# EAGLE design twitterer (EAGLE 7.1.0)
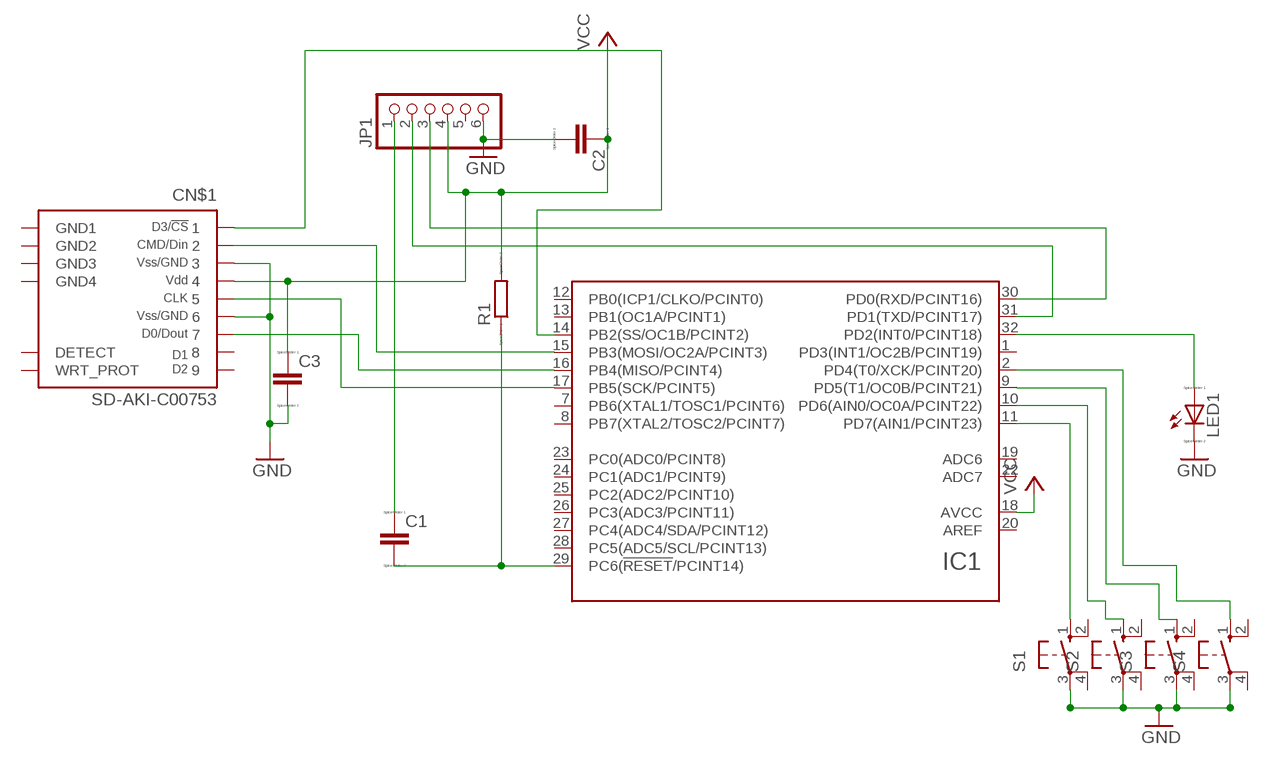
[diagram p0: schematic, sheet 1]

## Parts
C1  CC0603  [C0603]
C2  CC0603  [C0603]
C3  CC0603  [C0603]
CN$1  SD-AKI-C00753  [C-1734234]
IC1  ATMEGA48/88/168/328-AU  [TQFP32-08]
JP1  PINHD-1X6  [1X06]
LED1  LED_ELD260  [LED_LD260]
R1  RR0603  [R0603]
S1  10-XX  [B3F-10XX]
S2  10-XX  [B3F-10XX]
S3  10-XX  [B3F-10XX]
S4  10-XX  [B3F-10XX]

## Nets
GND: C2.2 C3.2 CN$1.3 CN$1.6 JP1.6 LED1.K(C) S1.3(P) S2.3(P) S3.3(P) S4.3(P)
N$1: C1.1 JP1.1
N$2: C1.2 IC1.29(PC6(!RESET!/PCINT14)) R1.1
N$3: IC1.31(PD1(TXD/PCINT17)) JP1.2
N$4: IC1.30(PD0(RXD/PCINT16)) JP1.3
N$5: CN$1.1 IC1.14(PB2(SS/OC1B/PCINT2))
N$6: CN$1.2 IC1.15(PB3(MOSI/OC2A/PCINT3))
N$11: CN$1.7 IC1.16(PB4(MISO/PCINT4))
N$12: CN$1.5 IC1.17(PB5(SCK/PCINT5))
N$13: IC1.32(PD2(INT0/PCINT18)) LED1.A
N$14: IC1.11(PD7(AIN1/PCINT23)) S1.1(S)
N$15: IC1.10(PD6(AIN0/OC0A/PCINT22)) S2.1(S)
N$16: IC1.9(PD5(T1/OC0B/PCINT21)) S3.1(S)
N$17: IC1.2(PD4(T0/XCK/PCINT20)) S4.1(S)
VCC: C2.1 C3.1 CN$1.4 IC1.18(AVCC) JP1.4 R1.2
Unconnected: CN$1.8 CN$1.9 CN$1.DETECT CN$1.WRT_PROT IC1.1(PD3(INT1/OC2B/PCINT19)) IC1.7(PB6(XTAL1/TOSC1/PCINT6)) IC1.8(PB7(XTAL2/TOSC2/PCINT7)) IC1.12(PB0(ICP1/CLKO/PCINT0)) IC1.13(PB1(OC1A/PCINT1)) IC1.19(ADC6) IC1.20(AREF) IC1.22(ADC7) IC1.23(PC0(ADC0/PCINT8)) IC1.24(PC1(ADC1/PCINT9)) IC1.25(PC2(ADC2/PCINT10)) IC1.26(PC3(ADC3/PCINT11)) IC1.27(PC4(ADC4/SDA/PCINT12)) IC1.28(PC5(ADC5/SCL/PCINT13)) JP1.5 S1.2(S1) S1.4(P1) S2.2(S1) S2.4(P1) S3.2(S1) S3.4(P1) S4.2(S1) S4.4(P1)

## Power pins joined to a net without a drawn wire
GND: IC1.3(GND) IC1.5(GND) IC1.21(GND)
GND1: CN$1.GND1
GND2: CN$1.GND2
GND3: CN$1.GND3
GND4: CN$1.GND4
VCC: IC1.4(UCC) IC1.6(UCC)

## Library data of the parts
C1-C3 = eagle-ltspice:C: CAPACITOR, European symbol; SPICEMODEL: NONE; SPICEPREFIX: C
CN$1 = sd-card:SD-AKI-C00753: SD Card slot C-00753 Manufacturer: Unknown Distributor: Akizuki denshi DataSheet: http://akizukidenshi.com/catalog/g/gC-00753/ Remarks: @150 © afwan 2009/01 afwan717-right@yahoo.co.jp
IC1 = atmel_tiny24-44-84tiny48-88mega48-88-168-328:ATMEGA48/88/168/328
JP1 = pinhead:PINHD-1X6: PIN HEADER
LED1 = eagle-ltspice:LED_E: LED Source: http://www.osram.convergy.de Source: www.luxeon.com Source: www.kingbright.com; SPICEMODEL: NONE; SPICEPREFIX: D; SPICETYPE: diode
R1 = eagle-ltspice:R: RESISTOR, European symbol; SPICEMODEL: NONE; SPICEPREFIX: R
S1-S4 = switch-omron:10-XX: OMRON SWITCH; MPN: B3F-1000; OC_FARNELL: 176432; OC_NEWARK: 36M3542

## Board
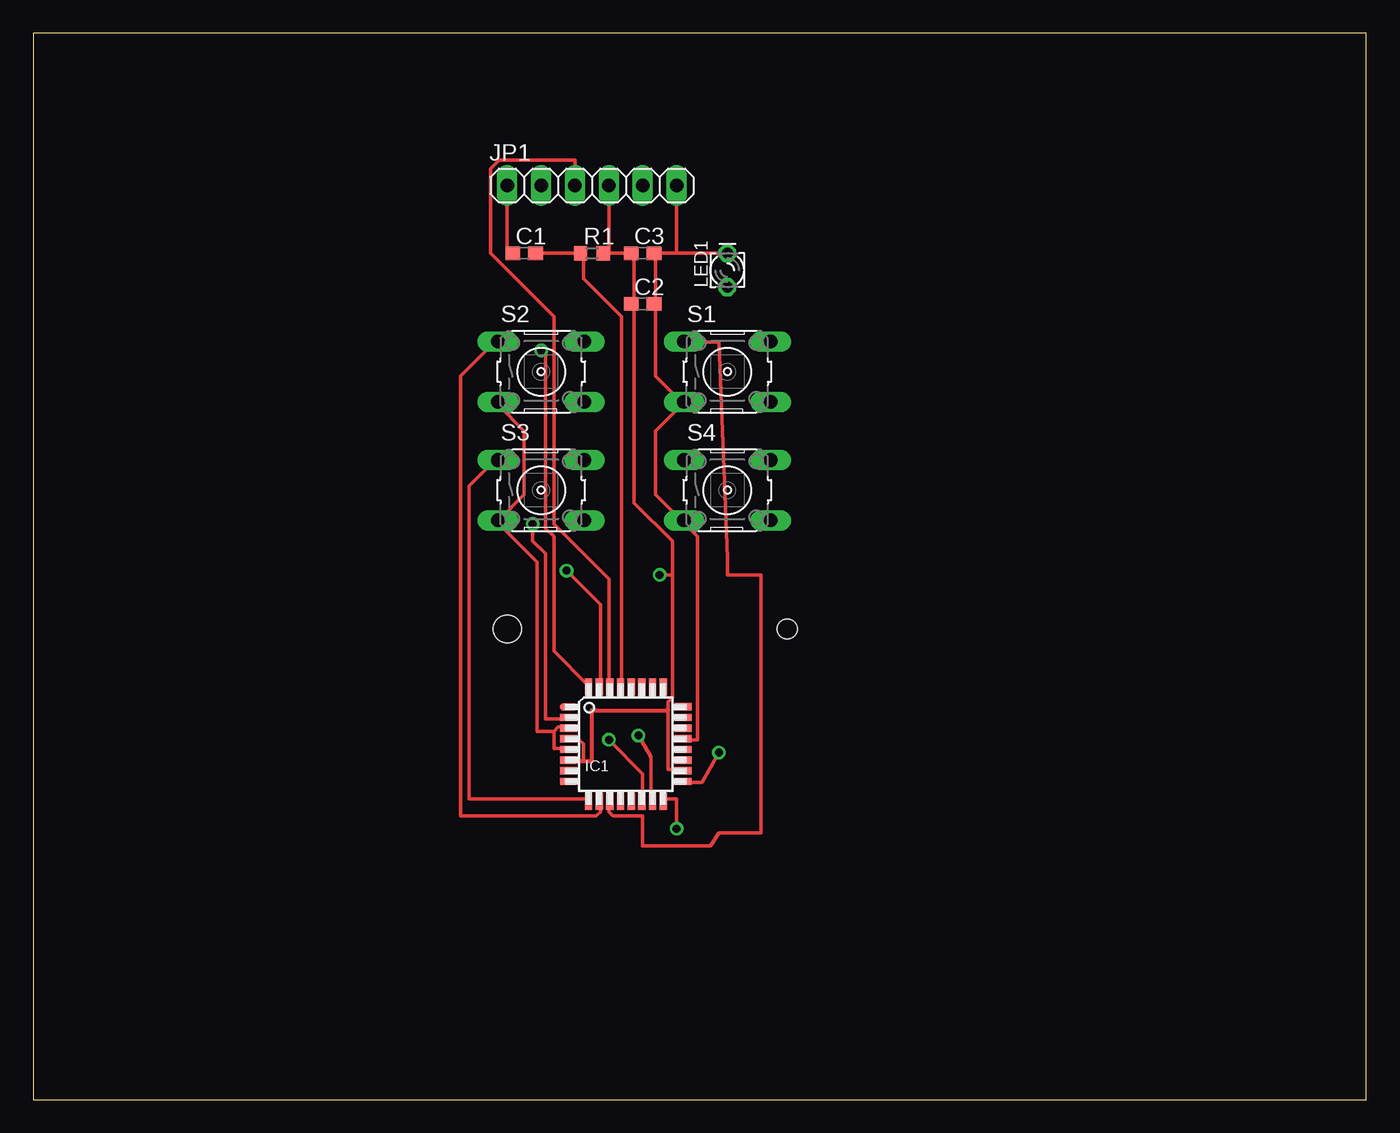
[diagram p1: board, top side]
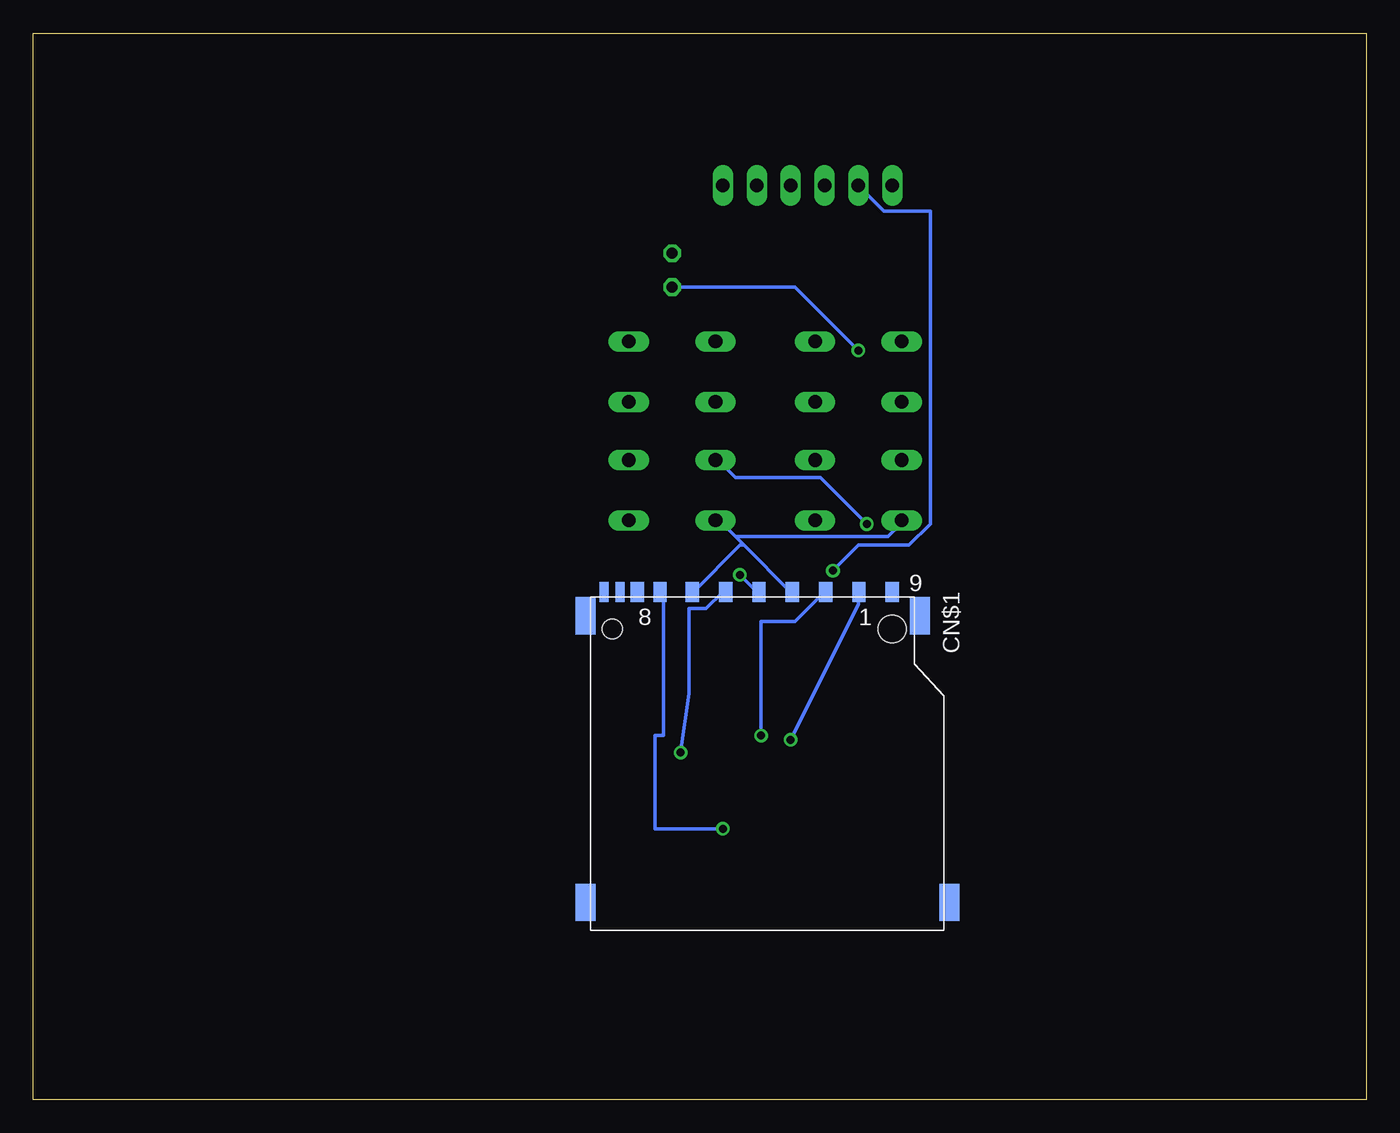
[diagram p2: board, bottom side, seen from below]

Size 100 x 80 mm. Coordinates in mm from the lower left corner, seen from the top.
Outline: 0,0 100,0 100,80 0,80 0,0
Copper layers (1*16): Top 0.035mm / dielectric 1.5mm / Bottom 0.035mm
Design rules "default": minimum track width 10mil, minimum drill 24mil, track to track 8mil, track to pad 8mil, pad to pad 8mil, via to via 8mil, smd to smd 8mil, copper to edge 40mil, drill to drill 8mil, minimum pad ring 10mil, minimum via ring 8mil, stop-mask expansion 4mil, vias tented up to drill 0mil, thermal gap 10mil

### Footprints (pad centres in the part's own frame; a part is rotated, then mirrored left to right if it is on the bottom)
C0603 = smd 1.1 x 1: 1 -0.85,0; 2 0.85,0
C-1734234 = smd 1 x 1.5: 1 -2.5,0; 2 -5,0; 3 -7.5,0; 4 -10,0; 5 -12.5,0; 6 -15,0; 7 -17.425,0; 8 -19.125,0; 9 0,0 | smd 0.7 x 1.5: DETECT -20.425,0; WRT_PROT -21.625,0 | smd 1.5 x 2.8: GND1 2.093,-1.8; GND2 -23.007,-1.8; GND3 -23.007,-23.3; GND4 4.293,-23.3 | hole 1.5: -21,-2.8 | hole 2.1: 0,-2.8
TQFP32-08 = smd 1.27 x 0.55: 1 -4.293,2.8; 2 -4.293,2; 3 -4.293,1.2; 4 -4.293,0.4; 5 -4.293,-0.4; 6 -4.293,-1.2; 7 -4.293,-2; 8 -4.293,-2.8; 17 4.293,-2.8; 18 4.293,-2; 19 4.293,-1.2; 20 4.293,-0.4; 21 4.293,0.4; 22 4.293,1.2; 23 4.293,2; 24 4.293,2.8 | smd 0.55 x 1.27: 9 -2.8,-4.293; 10 -2,-4.293; 11 -1.2,-4.293; 12 -0.4,-4.293; 13 0.4,-4.293; 14 1.2,-4.293; 15 2,-4.293; 16 2.8,-4.293; 25 2.8,4.293; 26 2,4.293; 27 1.2,4.293; 28 0.4,4.293; 29 -0.4,4.293; 30 -1.2,4.293; 31 -2,4.293; 32 -2.8,4.293
1X06 = drill 1.016 long: 1 -6.35,0; 2 -3.81,0; 3 -1.27,0; 4 1.27,0; 5 3.81,0; 6 6.35,0
LED_LD260 = drill 0.813 octagon: A -1.27,0; K 1.27,0
R0603 = smd 1 x 1.1: 1 -0.85,0; 2 0.85,0
B3F-10XX = drill 1.016 long: 1 -3.251,2.261; 2 3.251,2.261; 3 -3.251,-2.261; 4 3.251,-2.261

### Placement (x,y rotation side)
C1  36.83,63.5 0 top
C2  45.72,59.69 0 top
C3  45.72,63.5 0 top
CN$1  35.56,38.1 0 bottom
IC1  44.45,26.67 0 top
JP1  41.91,68.58 0 top
LED1  52.07,62.23 90 top
R1  41.91,63.5 0 top
S1  52.07,54.61 0 top
S2  38.1,54.61 0 top
S3  38.1,45.72 0 top
S4  52.07,45.72 0 top

### Tracks (layer width: path | path; a pad name or v marks a point on that pad's centre or on a via)
GND
  Top 0.254: 39.05,27.62 39.05,26.35 40.01,26.35 IC1.5 | 39.05,27.62 39.37,27.94 40.01,27.94 IC1.3 | 39.05,27.62 37.78,27.62 37.78,40.32 34.92,43.18 S3.3 34.92,43.5 36.83,45.4 36.83,50.16 34.92,52.07 S2.3 | 46.67,63.5 46.67,59.69 | LED1.K 48.26,63.5 | 48.26,63.5 46.67,63.5 | 46.67,63.5 C3.2 | 48.26,63.5 JP1.6 | 46.67,59.69 46.67,54.29 48.58,52.39 S1.3 48.58,52.07 46.67,50.16 46.67,45.4 48.58,43.5 S4.3 48.9,43.18 49.85,42.23 49.85,26.99 48.9,26.99 IC1.21 | 46.67,59.69 C2.2
  Bottom 0.254: 47.31,42.23 48.26,43.18 48.58,43.18 S4.3 | 47.31,42.23 46.67,41.59 | 46.67,41.59 43.18,38.1 CN$1.3 | 46.67,41.59 46.99,41.59 50.48,38.1 CN$1.6 | 47.31,42.23 35.88,42.23 34.92,43.18 S3.3
N$1
  Top 0.254: JP1.1 35.56,63.82 35.88,63.5 C1.1
N$2
  Top 0.254: C1.2 R1.1 41.27,63.5 41.27,61.59 44.13,58.74 44.13,31.11 IC1.29
N$3  (via drill 0.61)
  Top 0.254: v40.01,39.69 42.55,37.15 42.55,31.11 IC1.31
  Bottom 0.254: v40.01,39.69 38.1,41.59 34.29,41.59 32.7,43.18 32.7,66.67 36.2,66.67 JP1.2
N$4
  Top 0.254: JP1.3 40.64,70.48 34.92,70.48 34.29,69.85 34.29,63.5 39.05,58.74 39.05,43.18 43.18,39.05 43.18,31.11 IC1.30
N$5  (via drill 0.61)
  Top 0.254: v43.18,26.99 45.72,24.45 45.72,22.54 IC1.14
  Bottom 0.254: v43.18,26.99 38.1,37.15 38.1,38.1 CN$1.1
N$6  (via drill 0.61)
  Top 0.254: v45.4,27.3 46.35,25.72 46.35,22.54 IC1.15
  Bottom 0.254: v45.4,27.3 45.4,35.88 42.86,35.88 40.64,38.1 CN$1.2
N$11  (via drill 0.61)
  Top 0.254: v48.26,20.32 48.26,22.54 47.31,22.54 IC1.16
  Bottom 0.254: v48.26,20.32 53.34,20.32 53.34,27.3 52.7,27.3 52.7,38.1 CN$1.7
N$12  (via drill 0.61)
  Top 0.254: v51.44,26.04 50.16,23.81 48.9,23.81 IC1.17
  Bottom 0.254: v51.44,26.04 50.8,30.48 50.8,36.83 49.53,36.83 48.26,38.1 CN$1.5
N$13  (via drill 0.61)
  Top 0.254: v38.1,56.2 38.42,55.88 38.42,42.86 39.05,42.23 39.05,33.66 41.59,31.11 IC1.32
  Bottom 0.254: v38.1,56.2 42.86,60.96 LED1.A
N$14
  Top 0.254: IC1.11 43.18,22.23 43.18,21.59 43.5,21.27 45.72,21.27 45.72,19.05 50.8,19.05 51.44,20 54.61,20 54.61,39.37 52.07,39.37 52.07,40.64 51.44,56.83 48.9,56.83 S1.1
N$15
  Top 0.254: IC1.10 42.55,22.23 42.55,21.59 42.23,21.27 32.07,21.27 32.07,54.29 34.61,56.83 S2.1
N$16
  Top 0.254: IC1.9 41.59,22.54 32.7,22.54 32.7,46.04 34.61,47.94 S3.1
N$17  (via drill 0.61)
  Top 0.254: v37.47,43.18 37.47,41.91 38.42,40.96 38.42,28.57 40.01,28.57 IC1.2
  Bottom 0.254: v37.47,43.18 40.96,46.67 47.31,46.67 48.58,47.94 S4.1
VCC  (via drill 0.61)
  Top 0.254: 43.18,63.5 C3.1 45.09,63.5 45.09,59.69 | 47.94,39.37 47.94,41.91 45.09,44.77 45.09,59.69 | 47.94,39.37 47.94,30.16 47.62,29.84 47.62,29.21 47.62,24.77 48.58,24.77 IC1.18 | 45.09,59.69 C2.1 | 47.94,39.37 v46.99,39.37 | 43.18,63.5 JP1.4 | 43.18,63.5 R1.2 | IC1.6 40.32,25.4 40.64,25.4 41.27,25.4 41.27,26.67 40.96,26.99 40.32,26.99 IC1.4
  Top 0.305: 40.64,25.4 41.91,25.4 41.91,29.21 47.62,29.21
  Bottom 0.254: v46.99,39.37 45.72,38.1 CN$1.4